# EAGLE schematic CityFireFly_1.0v (EAGLE 7.5.0)
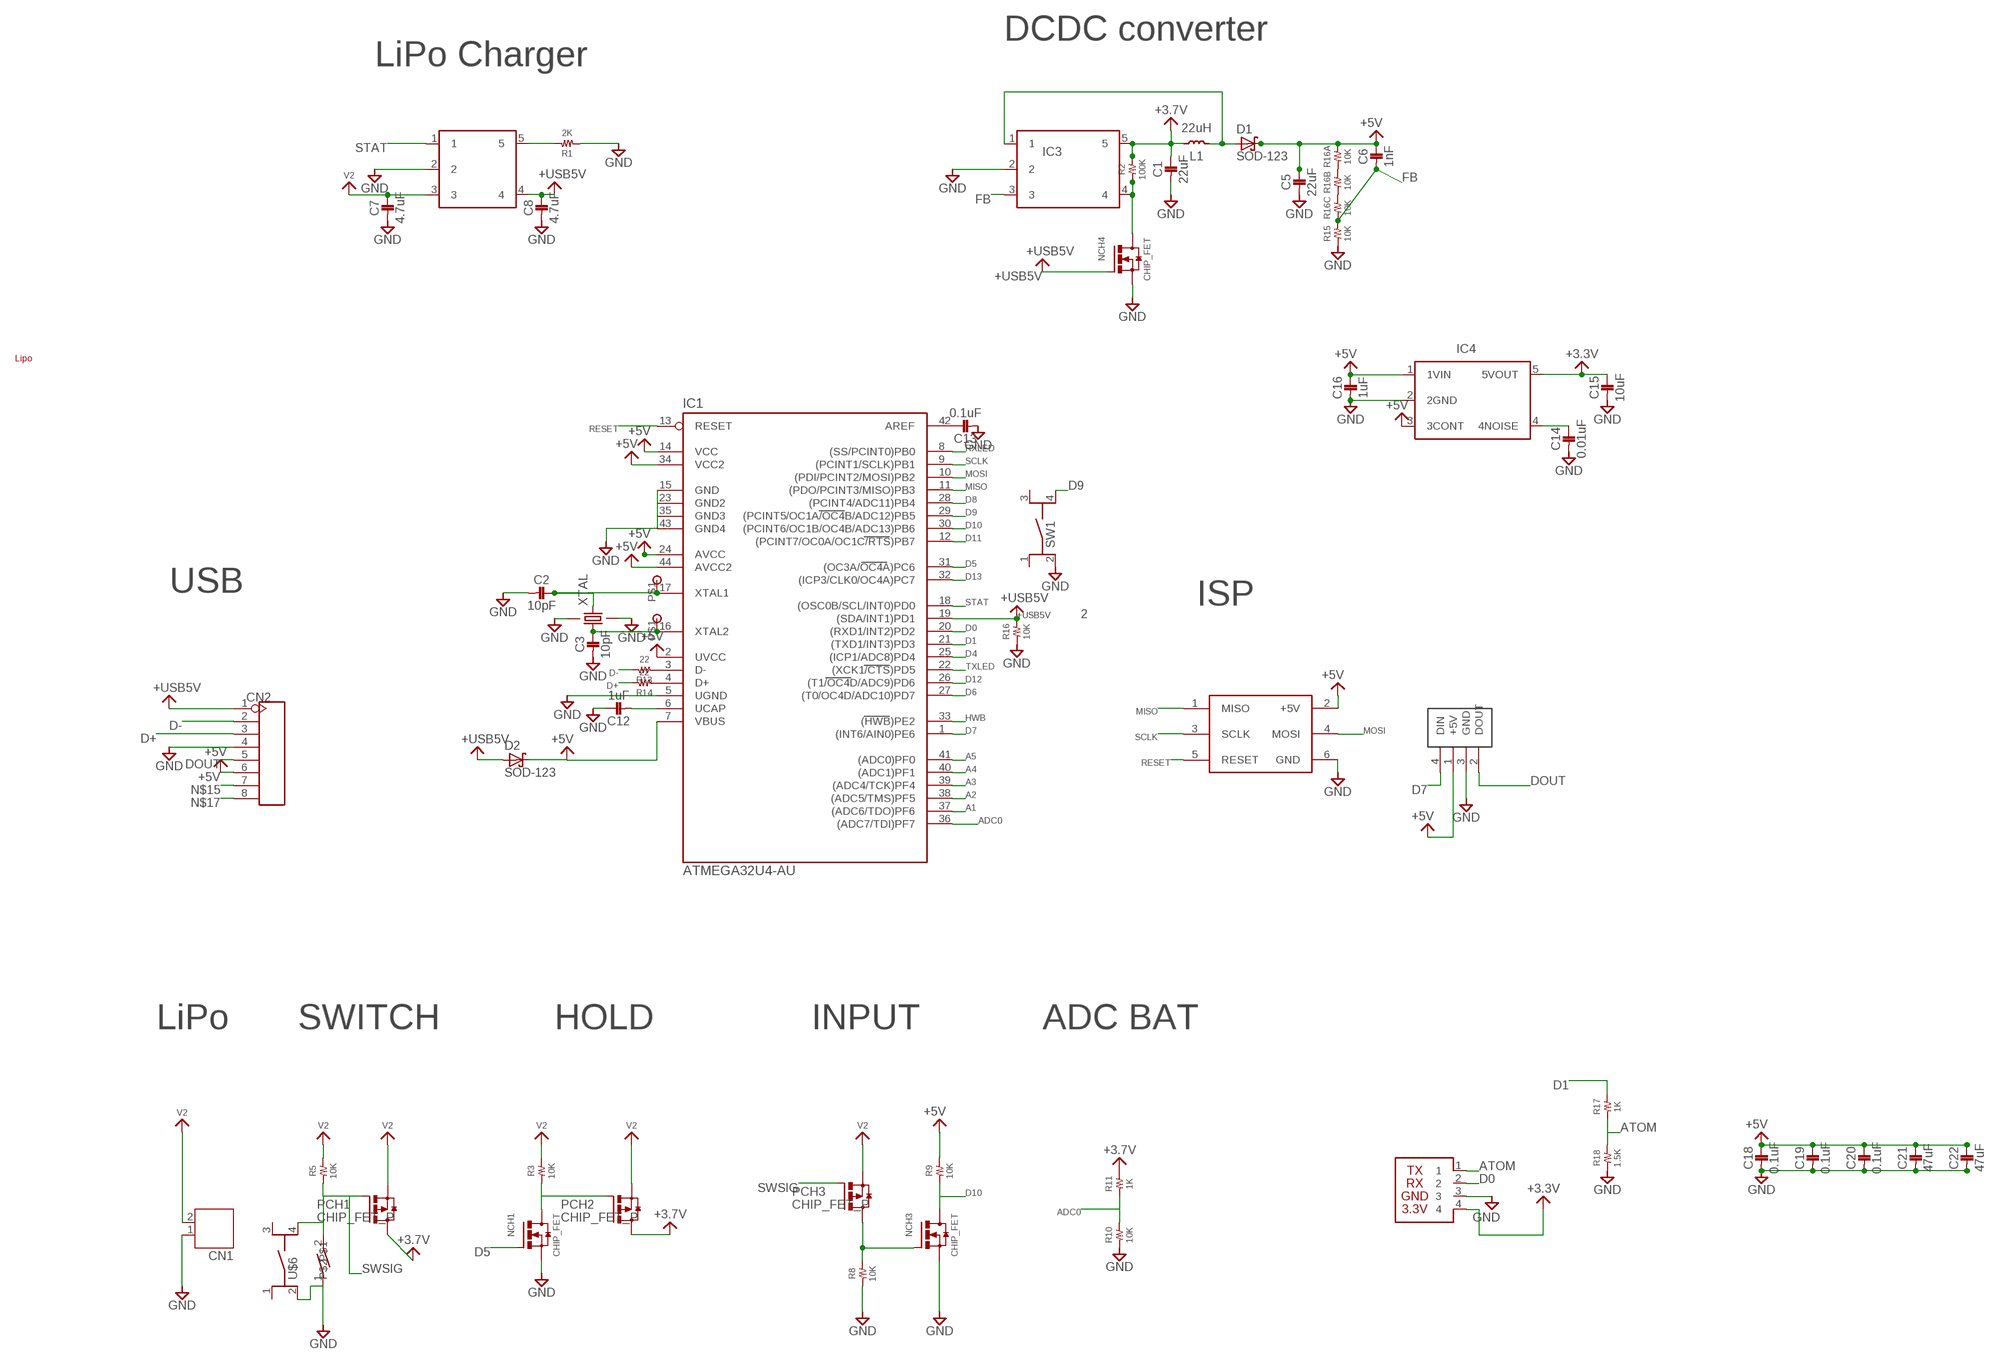
[diagram p0: schematic, sheet 1]

## Parts
BLE_SERIAL2  BLE_SERIAL2  [BLESERIAL2]
C1  22uF  1608  [1608]
C2  10pF  1608  [1608]
C3  10pF  1608  [1608]
C5  22uF  1608  [1608]
C6  1nF  1608  [1608]
C7  4.7uF  1608  [1608]
C8  4.7uF  1608  [1608]
C12  1uF  1608  [1608]
C13  0.1uF  1608  [1608]
C14  0.01uF  1608  [1608]
C15  10uF  1608  [1608]
C16  1uF  1608  [1608]
C18  0.1uF  1608  [1608]
C19  0.1uF  1608  [1608]
C20  0.1uF  1608  [1608]
C21  47uF  3225  [3225]
C22  47uF  3225  [3225]
CN1  JST-PH2  [JST-PH2]
CN2  HEADER-8P-M90  [8P-2.54-MALE-D90]
D1  SOD-123  [SOD_123]
D2  SOD-123  [SOD_123]
IC1  ATMEGA32U4-AU  [TQFP44]
IC2  MCP73831  [SOT23-5L]
IC3  LM2735  [SOT23-5L]
IC4  TAR5SB  [SSOP5-P-0.95]
L1  22uH  KYORITU  [KYORITU]
NCH1  CHIP_FET  [SOT23]
NCH3  CHIP_FET  [SOT23]
NCH4  CHIP_FET  [SOT23]
PCH1  CHIP_FET_P  [SOT23]
PCH2  CHIP_FET_P  [SOT23]
PCH3  CHIP_FET_P  [SOT23]
R1  2K  RESISTOR__SMD  [1608]
R2  100K  RESISTOR__SMD  [1608]
R3  10K  RESISTOR__SMD  [1608]
R5  10K  RESISTOR__SMD  [1608]
R8  10K  RESISTOR__SMD  [1608]
R9  10K  RESISTOR__SMD  [1608]
R10  10K  RESISTOR__SMD  [1608]
R11  1K  RESISTOR__SMD  [1608]
R13  22  RESISTOR__SMD  [1608]
R14  22  RESISTOR__SMD  [1608]
R15  10K  RESISTOR__SMD  [1608]
R16  10K  RESISTOR__SMD  [1608]
R16A  10K  RESISTOR__SMD  [1608]
R16B  10K  RESISTOR__SMD  [1608]
R16C  10K  RESISTOR__SMD  [1608]
R17  1K  RESISTOR__SMD  [1608]
R18  1.5K  RESISTOR__SMD  [1608]
SW1  SKRPACE010  [SKRP]
U$3  ICSP  [ICSP]
U$5  REEDSWITCH_MKA  [MKA-10110]
U$6  SKRPACE010  [SKRP]
U$32  NEO_FLAT  [NEO_FLAT]
U$69  CHECK_0.8MM  [CHECK_0.8MM]
U$70  CHECK_0.8MM  [CHECK_0.8MM]
U$73  LIPO750MAH  [LIPO750MAH]
XTAL  FA-238  [FA-238]

## Nets
+3.3V: BLE_SERIAL2.4 C15.P$1 IC4.5(5VOUT)
+3.7V: C1.P$1 IC3.5 L1.P$1 PCH1.3(D) PCH2.3(D) R2.2 R11.2
+5V: C5.P$1 C6.P$1 C16.P$1 C18.P$1 C19.P$1 C20.P$1 C21.P$1 C22.P$1 CN2.6 D1.C D2.C IC1.2(UVCC) IC1.7(VBUS) IC1.14(VCC) IC1.24(AVCC) IC1.34(VCC2) IC1.44(AVCC2) IC4.1(1VIN) IC4.3(3CONT) R9.2 R16A.2 U$3.2(+5V) U$32.1(+5V)
+USB5V: C8.P$1 CN2.1 D2.A IC1.19((SDA/INT1)PD1) IC2.4 NCH4.1(G) R16.2
A1: IC1.37((ADC6/TDO)PF6)
A2: IC1.38((ADC5/TMS)PF5)
A3: IC1.39((ADC4/TCK)PF4)
A4: IC1.40((ADC1)PF1)
A5: IC1.41((ADC0)PF0)
ADC0: IC1.36((ADC7/TDI)PF7) R10.2 R11.1
ATOM: BLE_SERIAL2.1 R17.1 R18.2
D0: BLE_SERIAL2.2 IC1.20((RXD1/INT2)PD2)
D1: IC1.21((TXD1/INT3)PD3) R17.2
D4: IC1.25((ICP1/ADC8)PD4)
D5: IC1.31((OC3A/OC4A)PC6) NCH1.1(G)
D6: IC1.27((T0/OC4D/ADC10)PD7)
D7: IC1.1((INT6/AIN0)PE6) U$32.4(DIN)
D8: IC1.28((PCINT4/ADC11)PB4)
D9: IC1.29((PCINT5/OC1A/OC4B/ADC12)PB5) SW1.4(2_)
D10: IC1.30((PCINT6/OC1B/OC4B/ADC13)PB6) NCH3.3(D) R9.1
D11: IC1.12((PCINT7/OC0A/OC1C/RTS)PB7)
D12: IC1.26((T1/OC4D/ADC9)PD6)
D13: IC1.32((ICP3/CLK0/OC4A)PC7)
D+: CN2.3 R14.2
D-: CN2.2 R13.2
DOUT: CN2.5 U$32.2(DOUT)
FB: C6.P$2 IC3.3 R15.2 R16C.1
GND: BLE_SERIAL2.3 C1.P$2 C2.P$2 C3.P$2 C5.P$2 C7.P$2 C8.P$2 C12.P$1 C13.P$2 C14.P$2 C15.P$2 C16.P$2 C18.P$2 C19.P$2 C20.P$2 C21.P$2 C22.P$2 CN1.1 CN2.4 IC1.5(UGND) IC1.15(GND) IC1.23(GND2) IC1.35(GND3) IC1.43(GND4) IC2.2 IC3.2 IC4.2(2GND) NCH1.2(S) NCH3.2(S) NCH4.2(S) R1.1 R8.1 R10.1 R15.1 R16.1 R18.1 SW1.2(1_) U$3.6(GND) U$5.1 U$6.2(1_) U$32.3(GND) XTAL.2 XTAL.4
HWB: IC1.33((HWB)PE2)
MISO: IC1.11((PDO/PCINT3/MISO)PB3) U$3.1(MISO)
MOSI: IC1.10((PDI/PCINT2/MOSI)PB2) U$3.4(MOSI)
N$2: IC2.5 R1.2
N$3: IC3.4 NCH4.3(D) R2.1
N$4: D1.A IC3.1 L1.P$2
N$5: R16A.1 R16B.2
N$6: NCH1.3(D) PCH2.1(G) R3.1
N$7: C3.P$1 IC1.16(XTAL2) U$70.P$1 XTAL.1
N$8: IC1.3(D-) R13.1
N$9: C13.P$1 IC1.42(AREF)
N$10: C2.P$1 IC1.17(XTAL1) U$69.P$1 XTAL.3
N$11: R16B.1 R16C.2
N$14: IC1.4(D+) R14.1
N$15: CN2.7
N$16: C14.P$1 IC4.4(4NOISE)
N$17: CN2.8
N$18: C12.P$2 IC1.6(UCAP)
RESET: IC1.13(RESET) U$3.5(RESET)
RXLED: IC1.8((SS/PCINT0)PB0)
SCLK: IC1.9((PCINT1/SCLK)PB1) U$3.3(SCLK)
SIG: NCH3.1(G) PCH3.3(D) R8.2
STAT: IC1.18((OSC0B/SCL/INT0)PD0) IC2.1
SWSIG: PCH1.1(G) PCH3.1(G) R5.1 U$5.2 U$6.4(2_)
TXLED: IC1.22((XCK1/CTS)PD5)
V2 [POWER]: C7.P$1 CN1.2 IC2.3 PCH1.2(S) PCH2.2(S) PCH3.2(S) R3.2 R5.2
Unconnected: SW1.1 SW1.3 U$6.1 U$6.3

## Notes on the sheet
- DCDC converter
- LiPo Charger
- USB
- ISP
- 2
- LiPo | SWITCH | HOLD | INPUT | ADC BAT

## Library data of the parts
BLE_SERIAL2 = 12_module:BLE_SERIAL2
C1-C3 C5-C8 C12-C16 C18-C20 = 02_C:1608
C21 C22 = 02_C:3225
CN1 = jst-ph (1):JST-PH2
CN2 = Connector :HEADER-8P
D1 D2 = 15_DIODE:SOD-123
IC1 = mega32U4:ATMEGA32U4-AU
IC2 = 04_IC:MCP73831
IC3 = 04_IC:LM2735
IC4 = 04_IC:TAR5SB
L1 = 03_L:KYORITU
NCH1 NCH3 NCH4 = 06_FET:CHIP_FET
PCH1-PCH3 = 06_FET:CHIP_FET_P
R1-R3 R5 R8-R11 R13-R16 R16A R16B R16C R17 R18 = 01_R:RESISTOR__SMD
SW1 U$6 = 09_1_switch:SKRPACE010
U$3 = 08_CONECTOR:ICSP
U$5 = 09_1_switch:REEDSWITCH_MKA
U$32 = 10_LED:NEO_FLAT
U$69 U$70 = 08_CONECTOR:CHECK_0.8MM
U$73 = 16_battery:LIPO750MAH
XTAL = 09_2_CRYSTAL:FA-238